# EasyEDA Pro project ProProject_nRF52840无线键盘_2024-02-15.epro, schematic Schematic3

## Sheets
1 小键盘按键: Create Date: 2023-09-08; Page Name: P1; Project Name: 键盘成品; Schematic Name: Schematic3; Update Date: 2023-09-08; Company: 嘉立创EDA; Page Size: A4; Version: V1.0
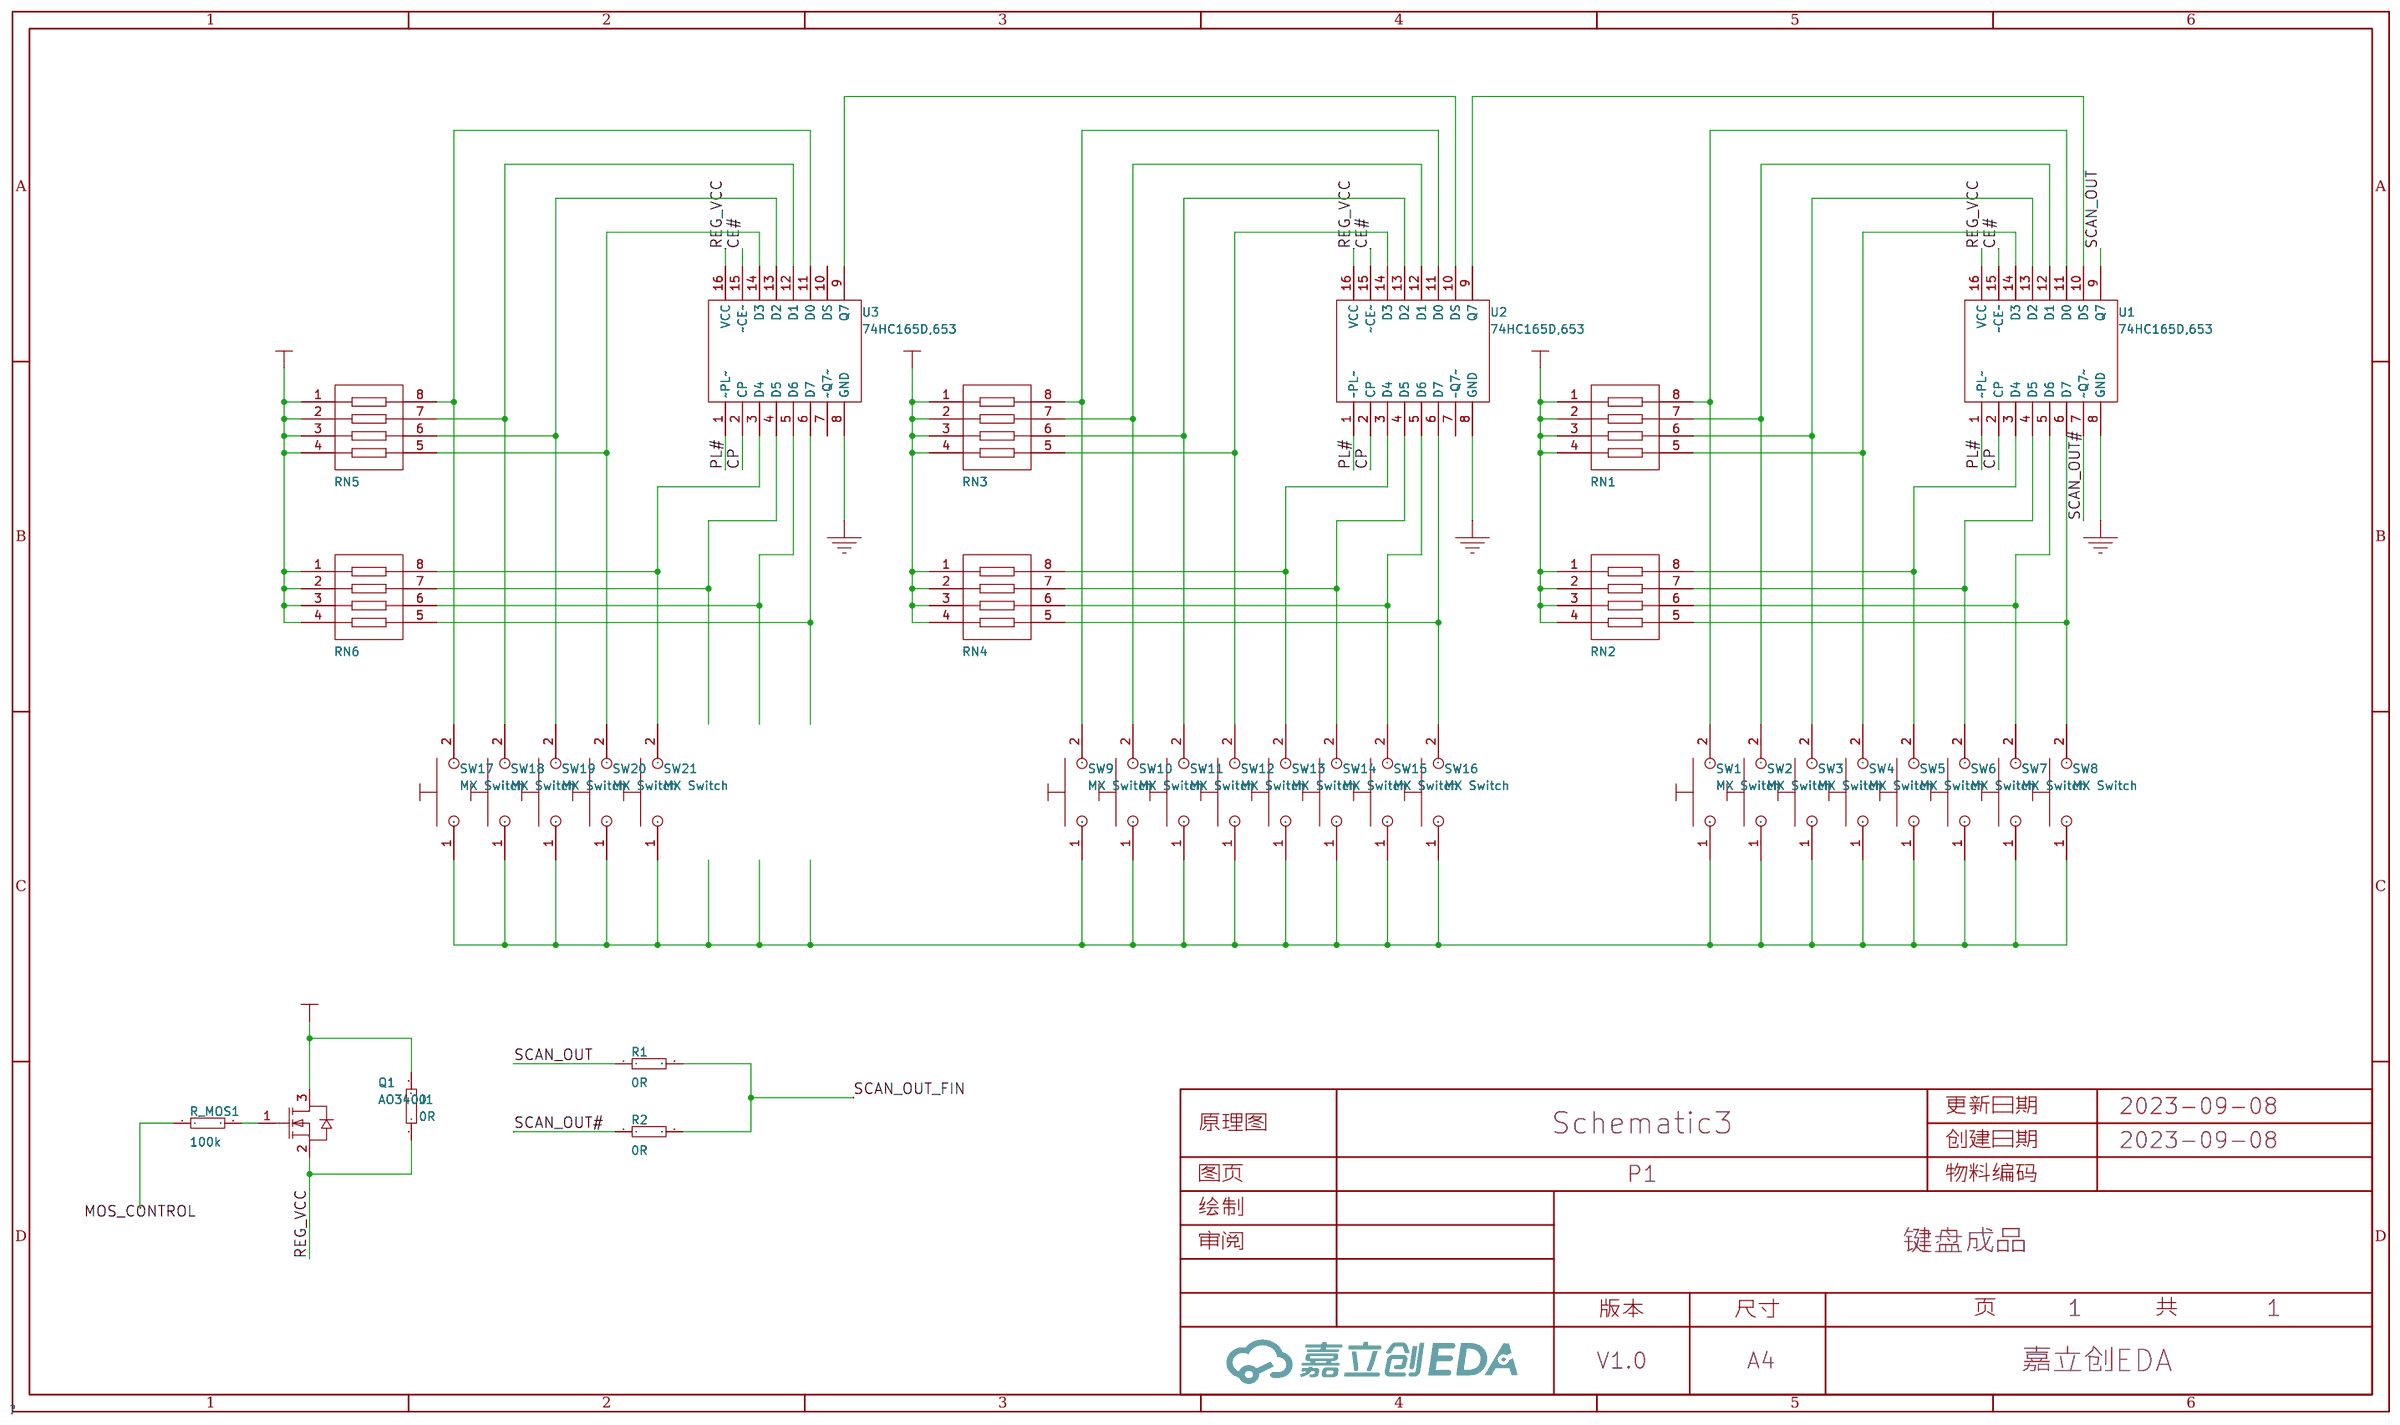
[diagram p0: 小键盘按键]
2 小键盘其他: Page Name: 小键盘其他
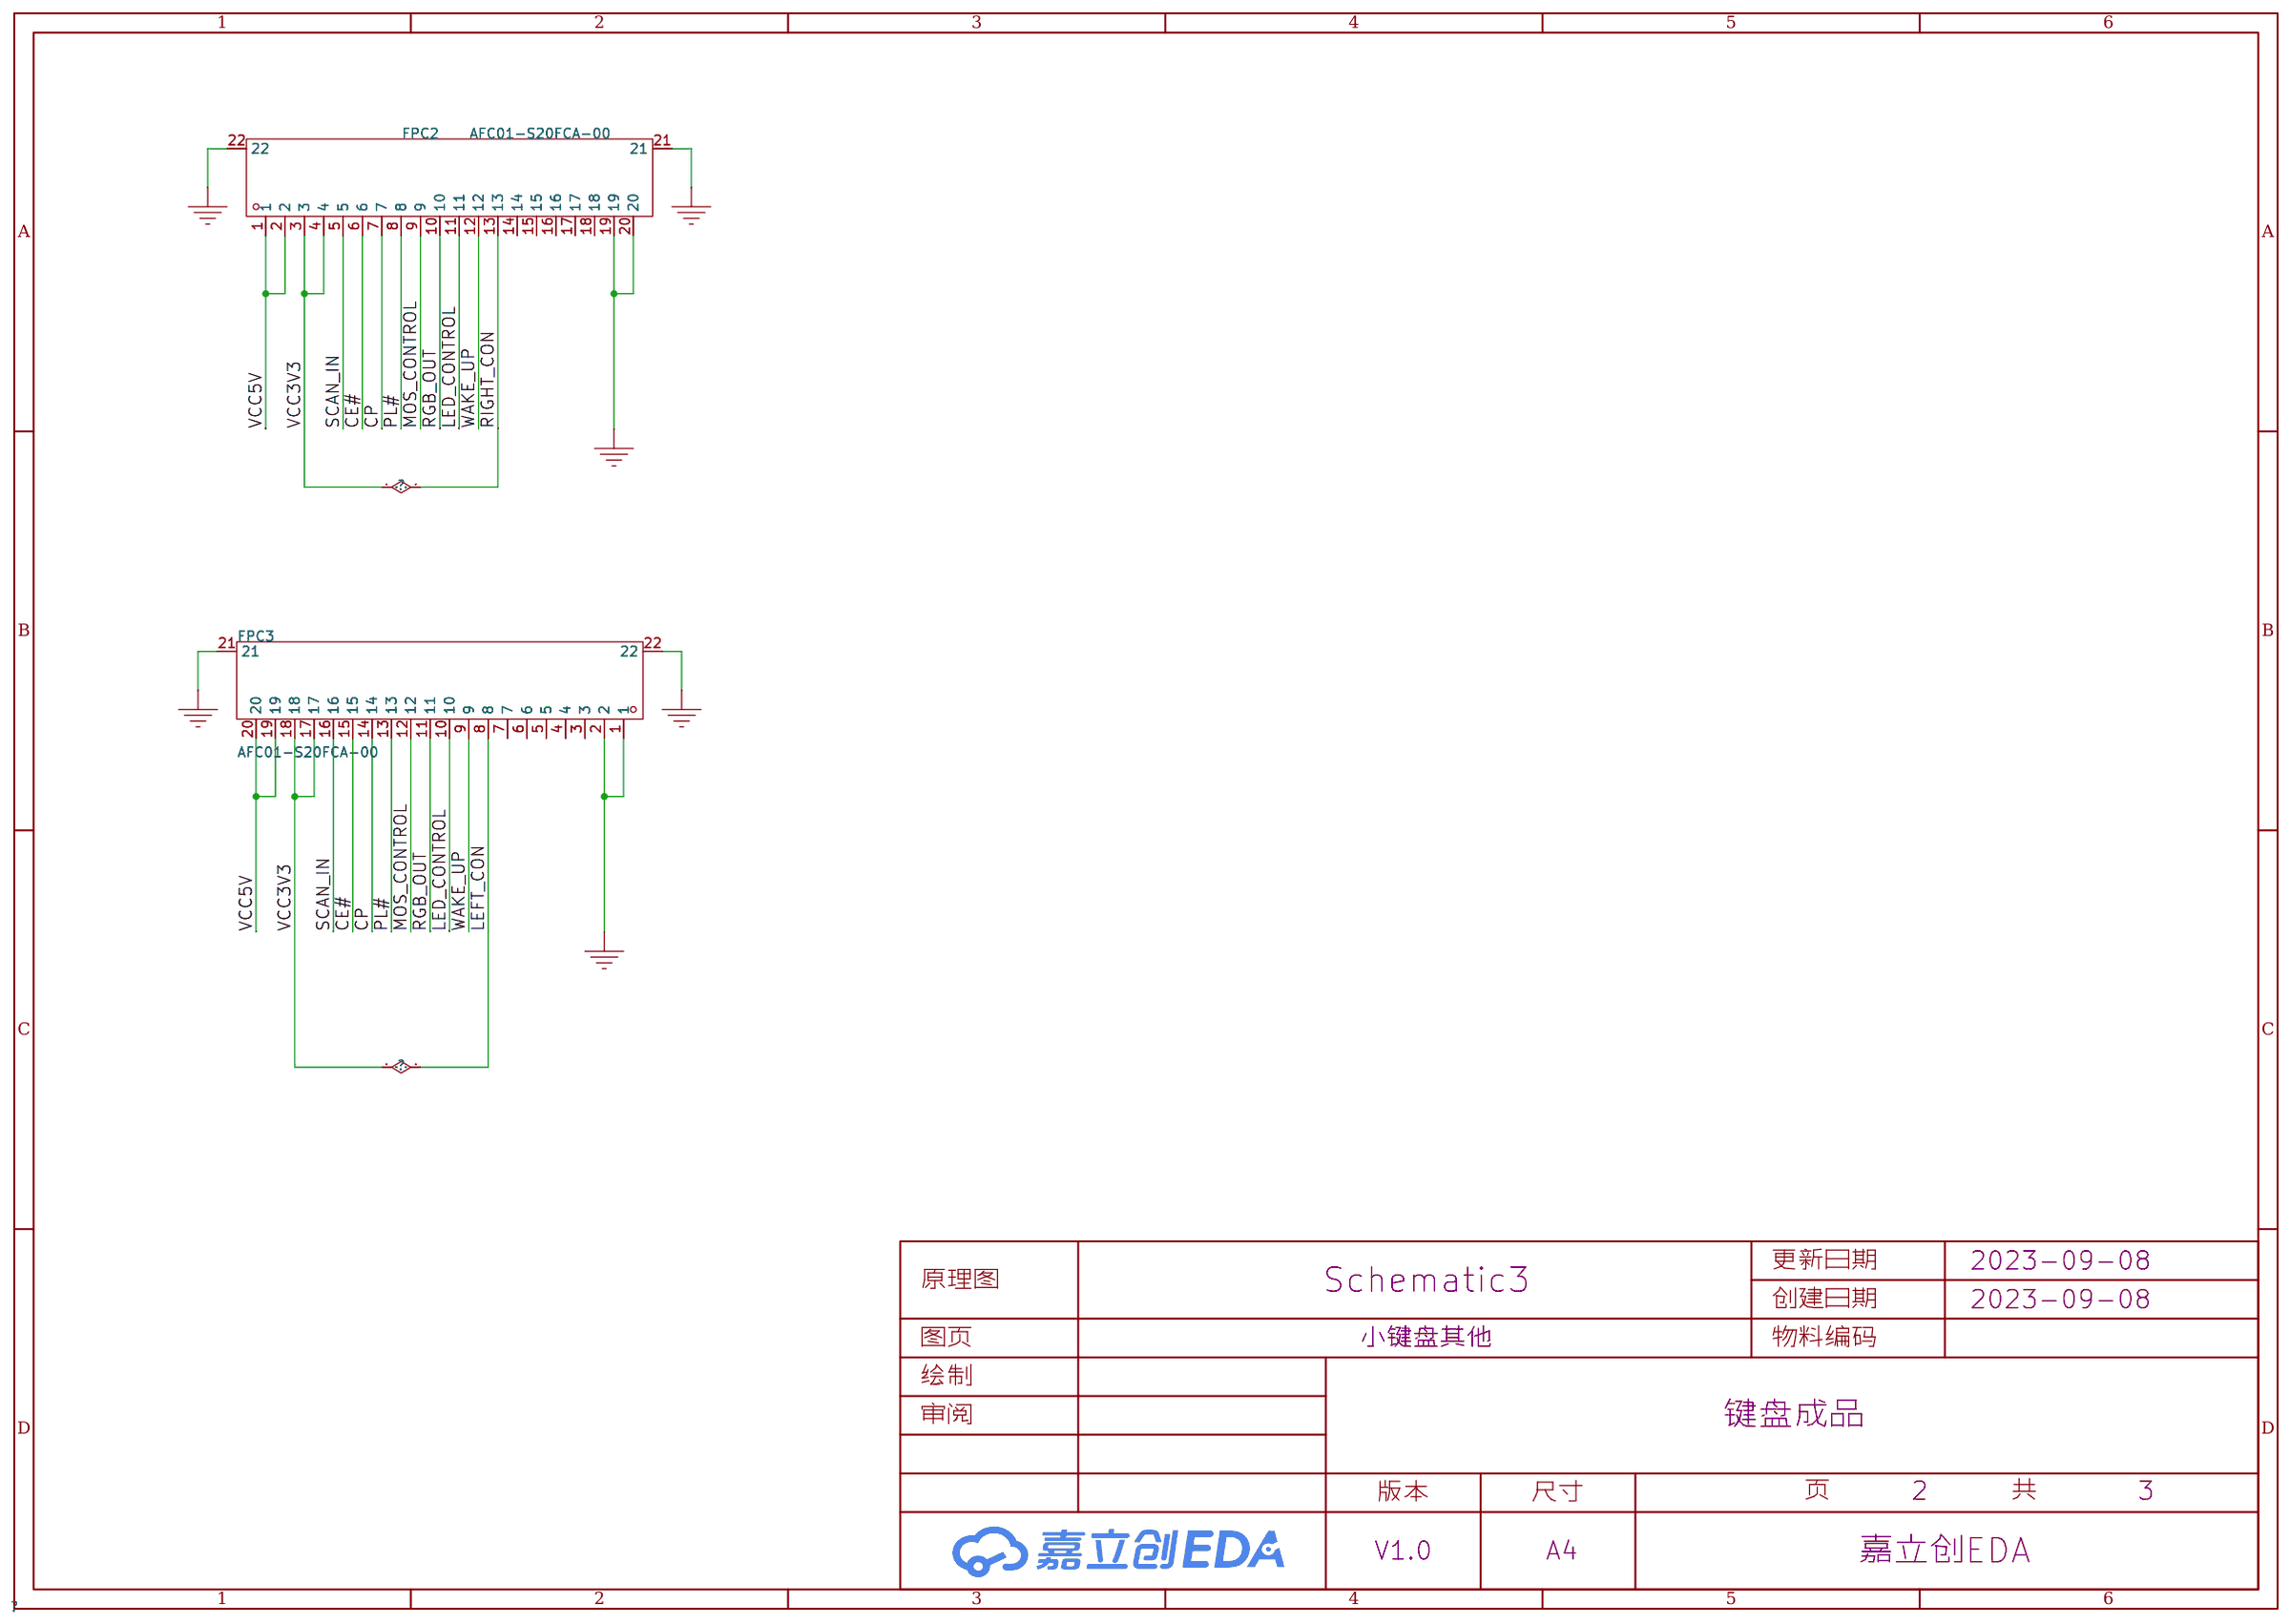
[diagram p1: 小键盘其他]
3 小键盘RGB: Page Name: 小键盘RGB
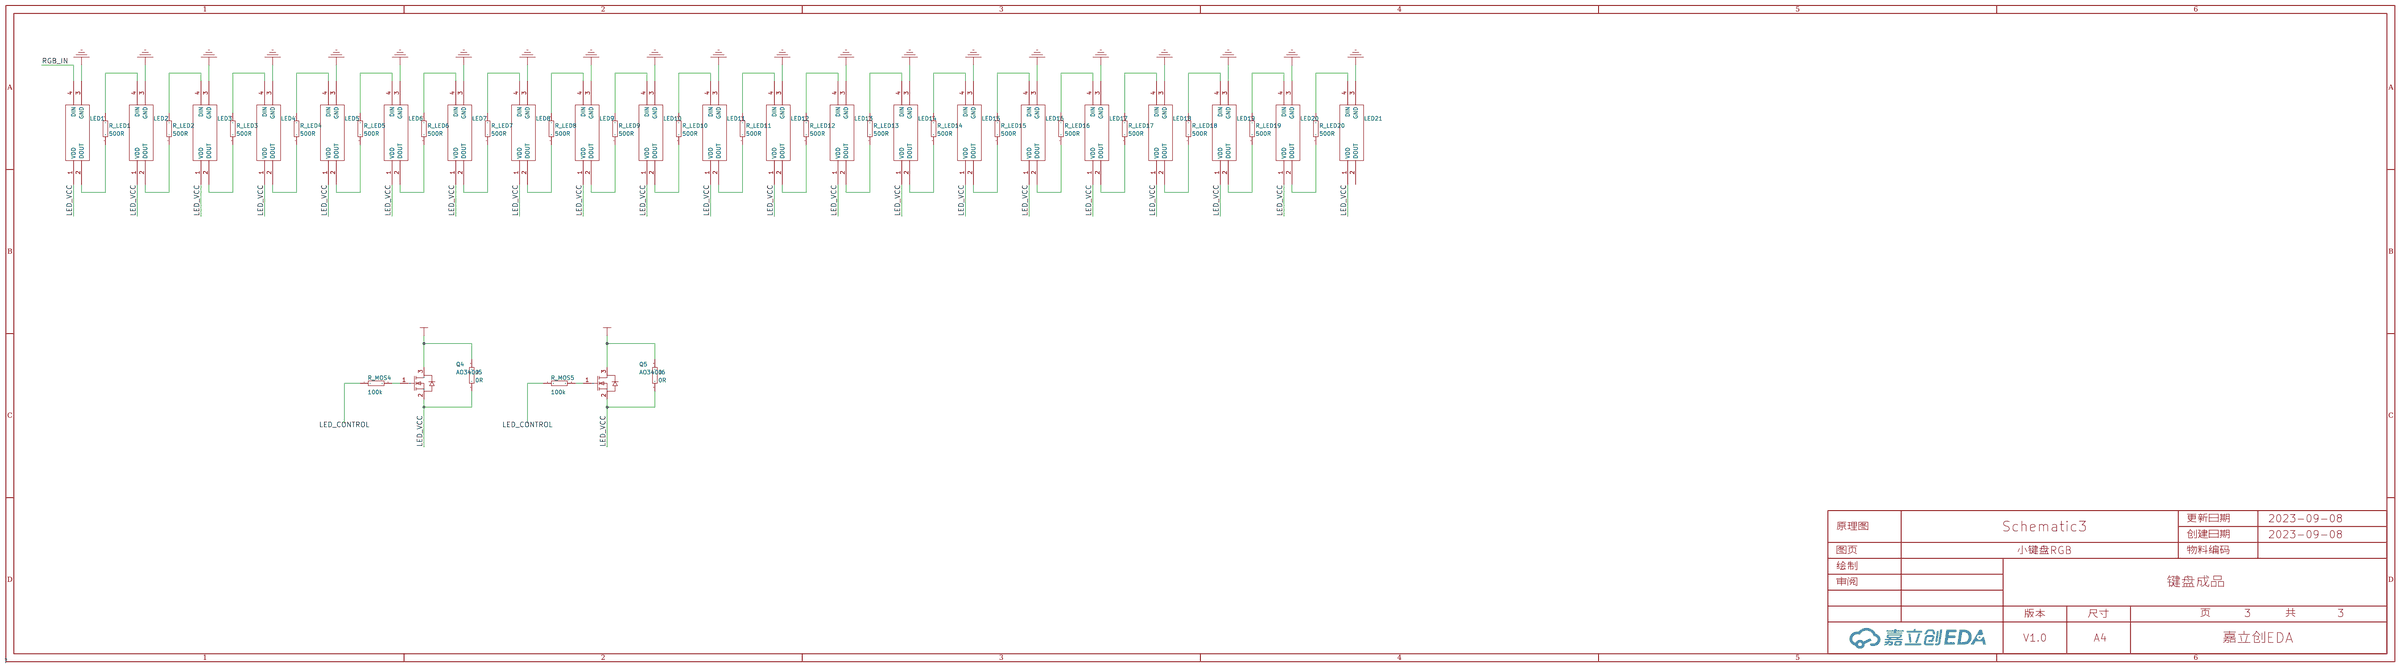
[diagram p2: 小键盘RGB]

## Parts
sheet 小键盘RGB
J5  0R  [0805]
J6  0R  [0805]
LED1  WS2812_3528LED  [WS2812_3528LED]
LED2  WS2812_3528LED  [WS2812_3528LED]
LED3  WS2812_3528LED  [WS2812_3528LED]
LED4  WS2812_3528LED  [WS2812_3528LED]
LED5  WS2812_3528LED  [WS2812_3528LED]
LED6  WS2812_3528LED  [WS2812_3528LED]
LED7  WS2812_3528LED  [WS2812_3528LED]
LED8  WS2812_3528LED  [WS2812_3528LED]
LED9  WS2812_3528LED  [WS2812_3528LED]
LED10  WS2812_3528LED  [WS2812_3528LED]
LED11  WS2812_3528LED  [WS2812_3528LED]
LED12  WS2812_3528LED  [WS2812_3528LED]
LED13  WS2812_3528LED  [WS2812_3528LED]
LED14  WS2812_3528LED  [WS2812_3528LED]
LED15  WS2812_3528LED  [WS2812_3528LED]
LED16  WS2812_3528LED  [WS2812_3528LED]
LED17  WS2812_3528LED  [WS2812_3528LED]
LED18  WS2812_3528LED  [WS2812_3528LED]
LED19  WS2812_3528LED  [WS2812_3528LED]
LED20  WS2812_3528LED  [WS2812_3528LED]
LED21  WS2812_3528LED  [WS2812_3528LED]
Q4  AO3400  [SOT-23_L2.9-W1.3-P1.90-LS2.4-BR]
Q5  AO3400  [SOT-23_L2.9-W1.3-P1.90-LS2.4-BR]
R_LED1  500R  [0805]
R_LED2  500R  [0805]
R_LED3  500R  [0805]
R_LED4  500R  [0805]
R_LED5  500R  [0805]
R_LED6  500R  [0805]
R_LED7  500R  [0805]
R_LED8  500R  [0805]
R_LED9  500R  [0805]
R_LED10  500R  [0805]
R_LED11  500R  [0805]
R_LED12  500R  [0805]
R_LED13  500R  [0805]
R_LED14  500R  [0805]
R_LED15  500R  [0805]
R_LED16  500R  [0805]
R_LED17  500R  [0805]
R_LED18  500R  [0805]
R_LED19  500R  [0805]
R_LED20  500R  [0805]
R_MOS4  100k  [0805]
R_MOS5  100k  [0805]
sheet 小键盘其他
FPC2  AFC01-S20FCA-00  [FPC-SMD_P0.5-20P_FGS-XJ-H2.0]
FPC3  AFC01-S20FCA-00  [FPC-SMD_P0.5-20P_FGS-XJ-H2.0]
sheet 小键盘按键
J1  0R  [0805]
Q1  AO3400  [SOT-23_L2.9-W1.3-P1.90-LS2.4-BR]
R1  0R  [0805]
R2  0R  [0805]
R_MOS1  100k  [0805]
RN1  10kΩ  [RES-ARRAY-SMD_0603-8P-L3.2-W1.6-BL]
RN2  10kΩ  [RES-ARRAY-SMD_0603-8P-L3.2-W1.6-BL]
RN3  10kΩ  [RES-ARRAY-SMD_0603-8P-L3.2-W1.6-BL]
RN4  10kΩ  [RES-ARRAY-SMD_0603-8P-L3.2-W1.6-BL]
RN5  10kΩ  [RES-ARRAY-SMD_0603-8P-L3.2-W1.6-BL]
RN6  10kΩ  [RES-ARRAY-SMD_0603-8P-L3.2-W1.6-BL]
SW1  MX Switch  [MX-Switch]
SW2  MX Switch  [MX-Switch]
SW3  MX Switch  [MX-Switch]
SW4  MX Switch  [MX-Switch]
SW5  MX Switch  [MX-Switch]
SW6  MX Switch  [MX-Switch]
SW7  MX Switch  [MX-Switch]
SW8  MX Switch  [MX-Switch]
SW9  MX Switch  [MX-Switch]
SW10  MX Switch  [MX-Switch]
SW11  MX Switch  [MX-Switch]
SW12  MX Switch  [MX-Switch]
SW13  MX Switch  [MX-Switch]
SW14  MX Switch  [MX-Switch]
SW15  MX Switch  [MX-Switch]
SW16  MX Switch  [MX-Switch]
SW17  MX Switch  [MX-Switch]
SW18  MX Switch  [MX-Switch]
SW19  MX Switch  [MX-Switch]
SW20  MX Switch  [MX-Switch]
SW21  MX Switch  [MX-Switch]
U1  74HC165D,653  [SOIC-16_L9.9-W3.9-P1.27-LS6.0-BL]
U2  74HC165D,653  [SOIC-16_L9.9-W3.9-P1.27-LS6.0-BL]
U3  74HC165D,653  [SOIC-16_L9.9-W3.9-P1.27-LS6.0-BL]

## Library data of the parts
J1 J5 J6 R1 R2 R_LED1-R_LED20 R_MOS1 R_MOS4 R_MOS5 = Resistor: Library Name: Brian_Integrated_Lib
LED1-LED21 = WS2812_3528LED: Library Name: Brian_Integrated_Lib
Q1 Q4 Q5 = AO3400_C2938367: 类型:N沟道;漏源电压(Vdss):30V;连续漏极电流(Id):5.8A;功率(Pd):1.5W;导通电阻(RDS(on)@Vgs,Id):35mΩ@10V,5.8A;; LCSC Part Name: N沟道 30V 5.8A; Supplier Part: C2938367; Manufacturer: GOODWORK(固得沃克); Supplier Footprint: SOT-23; JLCPCB Part Class: Extended Part; Datasheet: https://atta.szlcsc.com/upload/public/pdf/source/20211229/1DE691E24B5B31BB262C463D0489A9AB.pdf; Supplier: LCSC; Type: N沟道; Drain Source Voltage (Vdss): 30V; Continuous Drain Current (Id): 5.8A; Power Dissipation (Pd): 1.5W; Drain Source On Resistance (RDS(on)@Vgs,Id): 35mΩ@10V,5.8A; Gate Threshold Voltage (Vgs(th)@Id): 1.2V@250uA; Input Capacitance (Ciss@Vds): 1.05nF@15V; Reverse Transfer Capacitance (Crss@Vds): 77pF@15V; Operating Temperature: +150℃@(Tj); Library Name: Brian_Integrated_Lib; Datasheet Link: https://www.infineon.com/dgdl/irlml6344pbf.pdf?fileId=5546d462533600a4015356689c44262c; Height: 1.12mm; Manufacturer_Name: Infineon; Manufacturer_Part_Number: IRLML6344TRPBF; Mouser Part Number: 942-IRLML6344TRPBF; Mouser Price/Stock: https://www.mouser.co.uk/ProductDetail/Infineon-Technologies/IRLML6344TRPBF?qs=9%252BKlkBgLFf2w4qS48UOXVw%3D%3D; Arrow Part Number: IRLML6344TRPBF; Arrow Price/Stock: https://www.arrow.com/en/products/irlml6344trpbf/infineon-technologies-ag?region=europe
FPC2 FPC3 = AFC01-S20FCA-00: 间距:0.5mm;触点数量:20P;锁定特性:翻盖式;安装类型:卧贴;触点类型:下接;; LCSC Part Name: 0.5mm P数:20P 翻盖式 下接; Supplier Part: C262667; Manufacturer: JS(钜硕电子); Supplier Footprint: SMD,P=0.5mm; JLCPCB Part Class: Extended Part; Datasheet: https://atta.szlcsc.com/upload/public/pdf/source/20190816/C413942_2A72D1AC756EAE17EEDF756A339D4500.pdf; Supplier: LCSC; Pitch: 0.5mm; Number of Contacts: 20P; Locking Feature: 翻盖式; Mounting Type: 卧贴; Contact Type: 下接; Height Above Board: 2mm; FFC, FCB Thickness: 0.3mm; Design Item ID: FPC_20P; Library Name: Brian_Integrated_Lib
RN1-RN6 = 4D03WGJ0103T5E: 阻值:10kΩ;精度:±5%;单个元件功率:62.5mW;电阻器数:4;; LCSC Part Name: 10kΩ ±5%; Supplier Part: C29718; Manufacturer: UNI-ROYAL(厚声); Supplier Footprint: 0603x4; JLCPCB Part Class: Basic Part; Datasheet: https://atta.szlcsc.com/upload/public/pdf/source/20170615/1497511005633.pdf; Supplier: LCSC; Tolerance: ±5%; Power(Watts): 62.5mW; Number of Resistors: 4; Number of Pins: 8; Temperature Coefficient: ±200ppm/℃; Design Item ID: 排阻; Library Name: Brian_Integrated_Lib; Datasheet Link: https://industrial.panasonic.com/cdbs/www-data/pdf/AOC0000/AOC0000C14.pdf; Height: 0mm; Manufacturer_Name: Panasonic; Manufacturer_Part_Number: EXB-V8V152JV; Mouser Part Number: 667-EXB-V8V152JV; Mouser Price/Stock: https://www.mouser.co.uk/ProductDetail/Panasonic/EXB-V8V152JV?qs=uA7cY%2Fh6FfU1uZhF3xaZgw%3D%3D; Arrow Part Number: EXB-V8V152JV; Arrow Price/Stock: https://www.arrow.com/en/products/exb-v8v152jv/panasonic?region=europe
SW1-SW21 = MX Switch: MX Keyboard Switch; Library Name: Brian_Integrated_Lib
U1-U3 = 74HC165D,653: 功能:并行或串行至串行;电源电压:2V~6V;; Supplier Part: C5613; Manufacturer: Nexperia(安世); Supplier Footprint: SOIC-16; JLCPCB Part Class: Basic Part; Datasheet: https://atta.szlcsc.com/upload/public/pdf/source/20160218/1457707760975.pdf; Supplier: LCSC; Output Type: 补充型; Function: 并行或串行至串行; Supply Voltage: 2V~6V; Operating Temperature: -40℃~+125℃; Design Item ID: 74HC165D; Library Name: Brian_Integrated_Lib; Datasheet Link: http://uk.rs-online.com/web/p/products/1776629P; Height: 1.75mm; RS Part Number: 1776629P; RS Price/Stock: http://uk.rs-online.com/web/p/products/1776629P; Manufacturer_Name: Nexperia; Manufacturer_Part_Number: 74HC165D,652

## Nets
GND: FPC2.19 FPC2.20 FPC2.21 FPC2.22 FPC3.1 FPC3.2 FPC3.21 FPC3.22 LED1.3(GND) LED2.3(GND) LED3.3(GND) LED4.3(GND) LED5.3(GND) LED6.3(GND) LED7.3(GND) LED8.3(GND) LED9.3(GND) LED10.3(GND) LED11.3(GND) LED12.3(GND) LED13.3(GND) LED14.3(GND) LED15.3(GND) LED16.3(GND) LED17.3(GND) LED18.3(GND) LED19.3(GND) LED20.3(GND) LED21.3(GND) U1.8(GND) U2.8(GND) U3.8(GND)
VCC3V3: FPC2.3 FPC2.4 FPC2.13 FPC3.8 FPC3.17 FPC3.18 J1.2 Q1.3(D) RN1.1 RN1.2 RN1.3 RN1.4 RN2.1 RN2.2 RN2.3 RN2.4 RN3.1 RN3.2 RN3.3 RN3.4 RN4.1 RN4.2 RN4.3 RN4.4 RN5.1 RN5.2 RN5.3 RN5.4 RN6.1 RN6.2 RN6.3 RN6.4
VCC5V: FPC2.1 FPC2.2 FPC3.19 FPC3.20 J5.2 J6.2 Q4.3(D) Q5.3(D)
CE#: FPC2.6 FPC3.15 U1.15(~CE~) U2.15(~CE~) U3.15(~CE~)
CP: FPC2.7 FPC3.14 U1.2(CP) U2.2(CP) U3.2(CP)
LED_CONTROL: FPC2.11 FPC3.10 R_MOS4.1 R_MOS5.1
LED_VCC: J5.1 J6.1 LED1.1(VDD) LED2.1(VDD) LED3.1(VDD) LED4.1(VDD) LED5.1(VDD) LED6.1(VDD) LED7.1(VDD) LED8.1(VDD) LED9.1(VDD) LED10.1(VDD) LED11.1(VDD) LED12.1(VDD) LED13.1(VDD) LED14.1(VDD) LED15.1(VDD) LED16.1(VDD) LED17.1(VDD) LED18.1(VDD) LED19.1(VDD) LED20.1(VDD) LED21.1(VDD) Q4.2(S) Q5.2(S)
MOS_CONTROL: FPC2.9 FPC3.12 R_MOS1.1
PL#: FPC2.8 FPC3.13 U1.1(~PL~) U2.1(~PL~) U3.1(~PL~)
REG_VCC: J1.1 Q1.2(S) U1.16(VCC) U2.16(VCC) U3.16(VCC)
RGB_IN: LED1.4(DIN)
RGB_OUT: FPC2.10 FPC3.11
SCAN_IN: FPC2.5 FPC3.16
SCAN_OUT: R1.1 U1.9(Q7)
SCAN_OUT#: R2.1 U1.7(~Q7~)
SCAN_OUT_FIN: R1.2 R2.2
WAKE_UP: FPC2.12 FPC3.9
$1N1356: RN1.8 SW1.2 U1.11(D0)
$1N1362: RN1.7 SW2.2 U1.12(D1)
$1N1368: RN1.6 SW3.2 U1.13(D2)
$1N1374: RN1.5 SW4.2 U1.14(D3)
$1N1380: RN2.8 SW5.2 U1.3(D4)
$1N1386: RN2.7 SW6.2 U1.4(D5)
$1N1392: RN2.6 SW7.2 U1.5(D6)
$1N1398: RN2.5 SW8.2 U1.6(D7)
$1N1434: RN3.8 SW9.2 U2.11(D0)
$1N1440: RN3.7 SW10.2 U2.12(D1)
$1N1446: RN3.6 SW11.2 U2.13(D2)
$1N1452: RN3.5 SW12.2 U2.14(D3)
$1N1458: RN4.8 SW13.2 U2.3(D4)
$1N1464: RN4.7 SW14.2 U2.4(D5)
$1N1470: RN4.6 SW15.2 U2.5(D6)
$1N1476: RN4.5 SW16.2 U2.6(D7)
$1N1500: RN6.5 U3.6(D7)
$1N1504: RN6.6 U3.5(D6)
$1N1510: RN6.7 U3.4(D5)
$1N1516: RN6.8 SW21.2 U3.3(D4)
$1N1522: RN5.5 SW20.2 U3.14(D3)
$1N1528: RN5.6 SW19.2 U3.13(D2)
$1N1534: RN5.7 SW18.2 U3.12(D1)
$1N1540: RN5.8 SW17.2 U3.11(D0)
$1N1563: U1.10(DS) U2.9(Q7)
$1N1567: U2.10(DS) U3.9(Q7)
$1N1607: SW1.1(2) SW2.1(2) SW3.1(2) SW4.1(2) SW5.1(2) SW6.1(2) SW7.1(2) SW8.1(2) SW9.1(2) SW10.1(2) SW11.1(2) SW12.1(2) SW13.1(2) SW14.1(2) SW15.1(2) SW16.1(2) SW17.1(2) SW18.1(2) SW19.1(2) SW20.1(2) SW21.1(2)
$1N2242: Q1.1(G) R_MOS1.2
$3N1927: LED1.2(DOUT) R_LED1.1
$3N1931: LED2.4(DIN) R_LED1.2
$3N1935: LED2.2(DOUT) R_LED2.1
$3N1939: LED3.4(DIN) R_LED2.2
$3N1948: LED3.2(DOUT) R_LED3.1
$3N1952: LED4.4(DIN) R_LED3.2
$3N1961: LED4.2(DOUT) R_LED4.1
$3N1965: LED5.4(DIN) R_LED4.2
$3N1974: LED5.2(DOUT) R_LED5.1
$3N1978: LED6.4(DIN) R_LED5.2
$3N1987: LED6.2(DOUT) R_LED6.1
$3N1991: LED7.4(DIN) R_LED6.2
$3N2000: LED7.2(DOUT) R_LED7.1
$3N2004: LED8.4(DIN) R_LED7.2
$3N2013: LED8.2(DOUT) R_LED8.1
$3N2017: LED9.4(DIN) R_LED8.2
$3N2026: LED9.2(DOUT) R_LED9.1
$3N2030: LED10.4(DIN) R_LED9.2
$3N2039: LED10.2(DOUT) R_LED10.1
$3N2043: LED11.4(DIN) R_LED10.2
$3N2052: LED11.2(DOUT) R_LED11.1
$3N2056: LED12.4(DIN) R_LED11.2
$3N2065: LED12.2(DOUT) R_LED12.1
$3N2069: LED13.4(DIN) R_LED12.2
$3N2078: LED13.2(DOUT) R_LED13.1
$3N2082: LED14.4(DIN) R_LED13.2
$3N2091: LED14.2(DOUT) R_LED14.1
$3N2095: LED15.4(DIN) R_LED14.2
$3N2104: LED15.2(DOUT) R_LED15.1
$3N2108: LED16.4(DIN) R_LED15.2
$3N2117: LED16.2(DOUT) R_LED16.1
$3N2121: LED17.4(DIN) R_LED16.2
$3N2130: LED17.2(DOUT) R_LED17.1
$3N2134: LED18.4(DIN) R_LED17.2
$3N2143: LED18.2(DOUT) R_LED18.1
$3N2147: LED19.4(DIN) R_LED18.2
$3N2156: LED19.2(DOUT) R_LED19.1
$3N2160: LED20.4(DIN) R_LED19.2
$3N2169: LED20.2(DOUT) R_LED20.1
$3N2173: LED21.4(DIN) R_LED20.2
$3N3790: Q4.1(G) R_MOS4.2
$3N3807: Q5.1(G) R_MOS5.2

Not connected (* = marked no-connect by the designer): FPC2 14 15 16 17 18; FPC3 3 4 5 6 7; LED21 2(DOUT); U2 7(~Q7~); U3 7(~Q7~) 10(DS)
